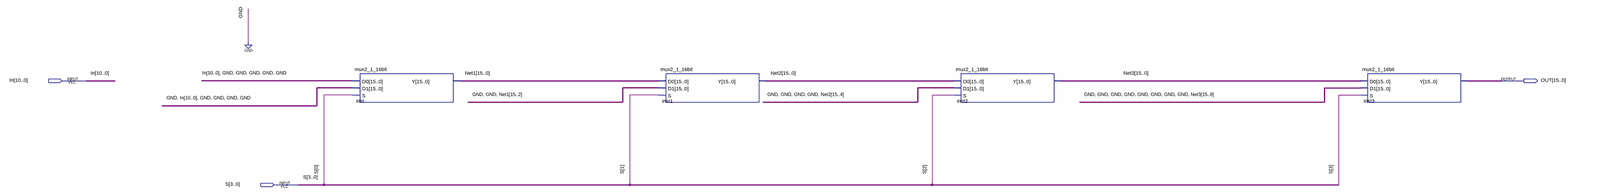
[diagram p0: schematic sheet, whole]
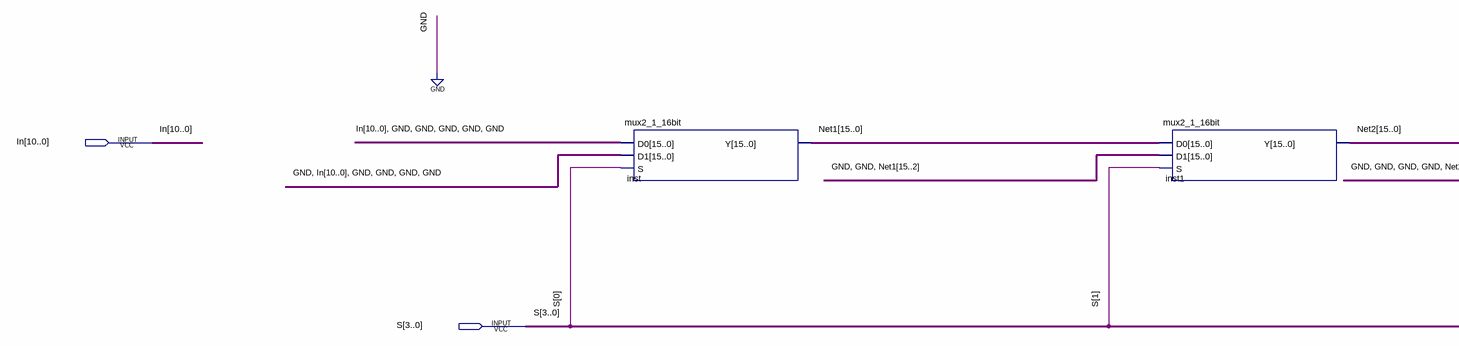
[diagram p1: schematic sheet, left part]
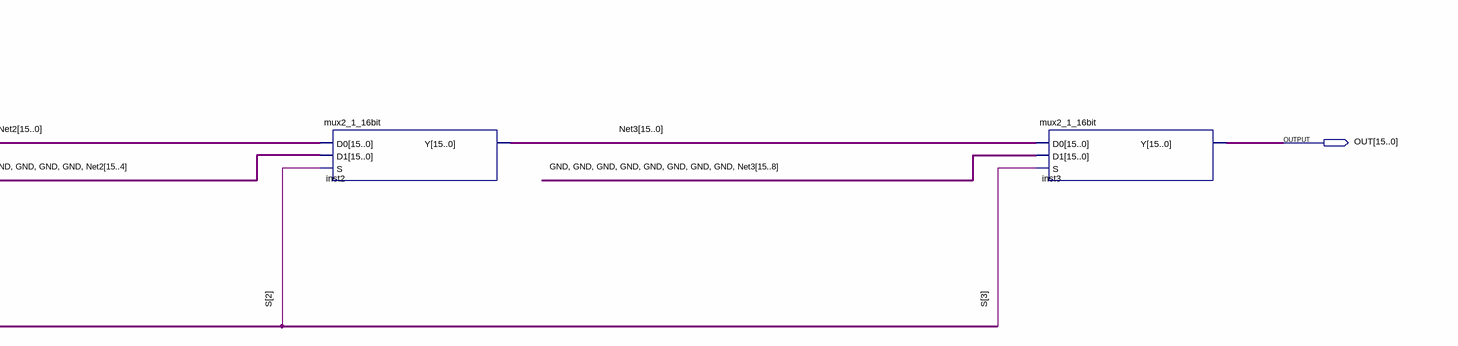
[diagram p2: schematic sheet, right part]
// Quartus schematic Shifter_right.bdf as structural Verilog: 4 symbols, 3 pins
module Shifter_right (
  input  [10:0] In,
  input  [3:0] S,
  output [15:0] OUT
);

  wire [15:0] Net1, Net2, Net3;

  mux2_1_16bit inst (.D0({In, {5{1'b0}}}), .D1({1'b0, In, 4'b0000}), .S(S[0]), .Y(Net1));
  mux2_1_16bit inst1 (.D0(Net1), .D1({2'b00, Net1[15:2]}), .S(S[1]), .Y(Net2));
  mux2_1_16bit inst2 (.D0(Net2), .D1({4'b0000, Net2[15:4]}), .S(S[2]), .Y(Net3));
  mux2_1_16bit inst3 (.D0(Net3), .D1({{8{1'b0}}, Net3[15:8]}), .S(S[3]), .Y(OUT));
endmodule
